# EAGLE design RGF_2_0 (EAGLE 8.3.2)
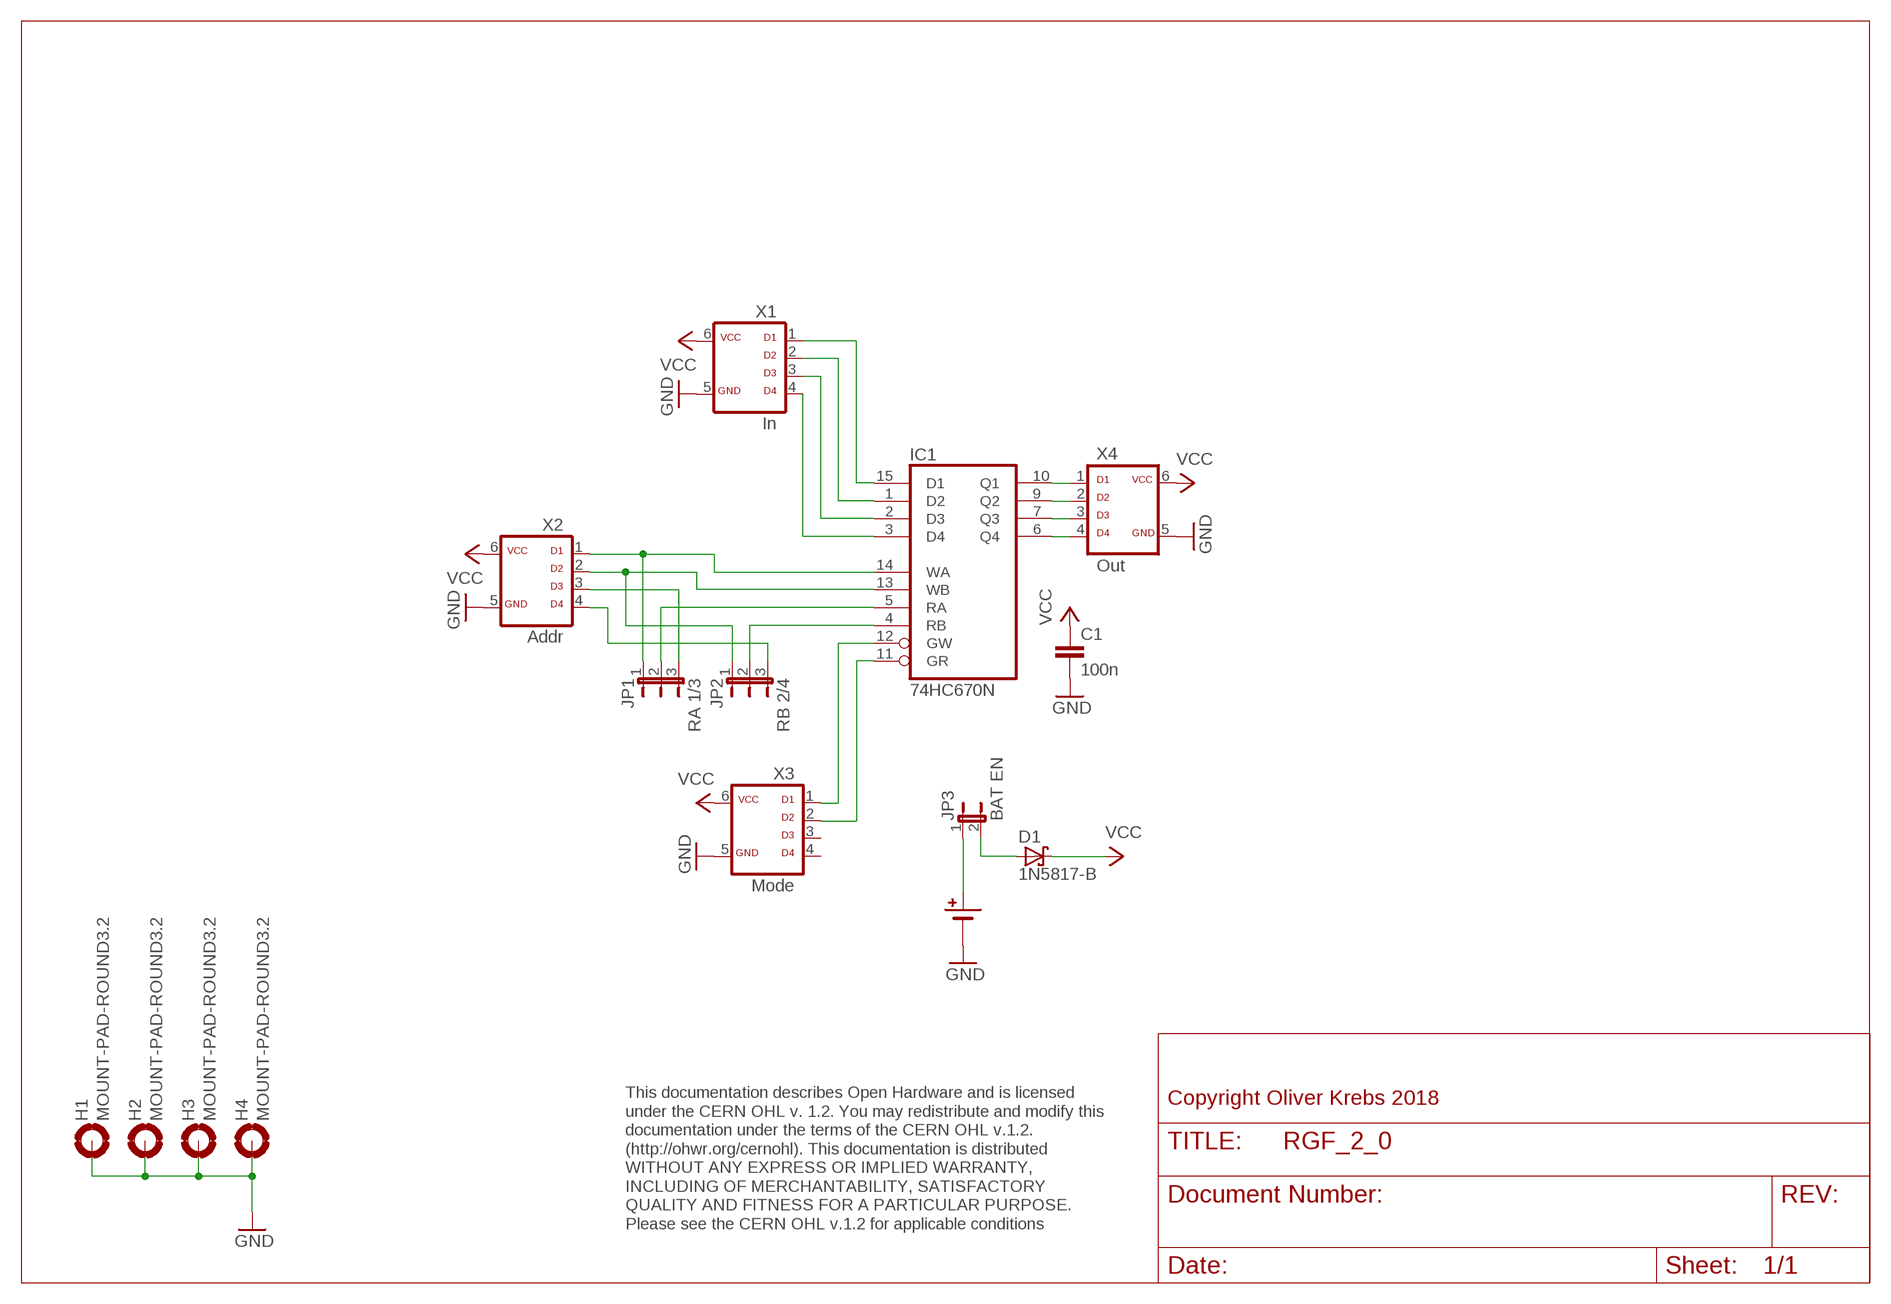
[diagram p0: schematic, sheet 1]

## Parts
C1  100n  C-EU050-025X075  [C050-025X075]
D1  1N5817-B  [DO41-7.6]
H1  MOUNT-PAD-ROUND3.2  [3,2-PAD]
H2  MOUNT-PAD-ROUND3.2  [3,2-PAD]
H3  MOUNT-PAD-ROUND3.2  [3,2-PAD]
H4  MOUNT-PAD-ROUND3.2  [3,2-PAD]
IC1  74HC670N  [DIL16]
JP1  RA 1/3  JP2EJP2-U  [JP2-U]
JP2  RB 2/4  JP2EJP2-U  [JP2-U]
JP3  BAT EN  JP1E  [JP1]
X1  In  ML6D  [ML-6]
X2  Addr  ML6D  [ML-6]
X3  Mode  ML6D  [ML-6]
X4  Out  ML6D  [ML-6]
X5  BATTERY  [KZH20SMD]

## Nets
GND: C1.2 H1.B3,2(MOUNT) H2.B3,2(MOUNT) H3.B3,2(MOUNT) H4.B3,2(MOUNT) X1.5 X2.5 X3.5 X4.5 X5.N1(MINUS)
N$1: IC1.15(D1) X1.1
N$2: IC1.1(D2) X1.2
N$3: IC1.2(D3) X1.3
N$4: IC1.3(D4) X1.4
N$5: IC1.9(Q2) X4.2
N$6: IC1.10(Q1) X4.1
N$7: IC1.7(Q3) X4.3
N$8: IC1.6(Q4) X4.4
N$9: IC1.14(WA) JP1.1 X2.1
N$10: JP1.3 X2.3
N$11: JP3.1 X5.P1(PLUS) X5.P2(PLUS)
N$13: JP2.3 X2.4
N$14: IC1.13(WB) JP2.1 X2.2
N$15: IC1.4(RB) JP2.2
N$16: IC1.5(RA) JP1.2
N$17: D1.A JP3.2
N$22: IC1.12(GW) X3.1
N$23: IC1.11(GR) X3.2
VCC: C1.1 D1.C X1.6 X2.6 X3.6 X4.6
Unconnected: X3.3 X3.4

## Notes on the sheet
- Copyright Oliver Krebs 2018
- This documentation describes Open Hardware and is licensed 
  under the CERN OHL v. 1.2. You may redistribute and modify this 
  documentation under the terms of the CERN OHL v.1.2. 
  (http://ohwr.org/cernohl). This documentation is distributed
  WITHOUT ANY EXPRESS OR IMPLIED WARRANTY, 
  INCLUDING OF MERCHANTABILITY, SATISFACTORY 
  QUALITY AND FITNESS FOR A PARTICULAR PURPOSE. 
  Please see the CERN OHL v.1.2 for applicable conditions

## Power pins joined to a net without a drawn wire
GND: IC1.8(GND)
VCC: IC1.16(VCC)

## Library data of the parts
C1 = 01-my_rcl:C-EU: CAPACITOR, European symbol
D1 = 01-my-diode:1N581*: 1.0A SCHOTTKY BARRIER RECTIFIER Source: http://www.diodes.com/datasheets/ds23001.pdf
H1-H4 = holes:MOUNT-PAD-ROUND: MOUNTING PAD, round
IC1 = 74xx-eu:74*670: 4 by 4 REGISTER FILES, 3-state
JP1 JP2 = 01-my-jumper:JP2E: JUMPER
JP3 = 01-my-jumper:JP1E: JUMPER
X1-X4 = 01-my-con:ML6D
X5 = 01-my-con:BATTERY

## Board
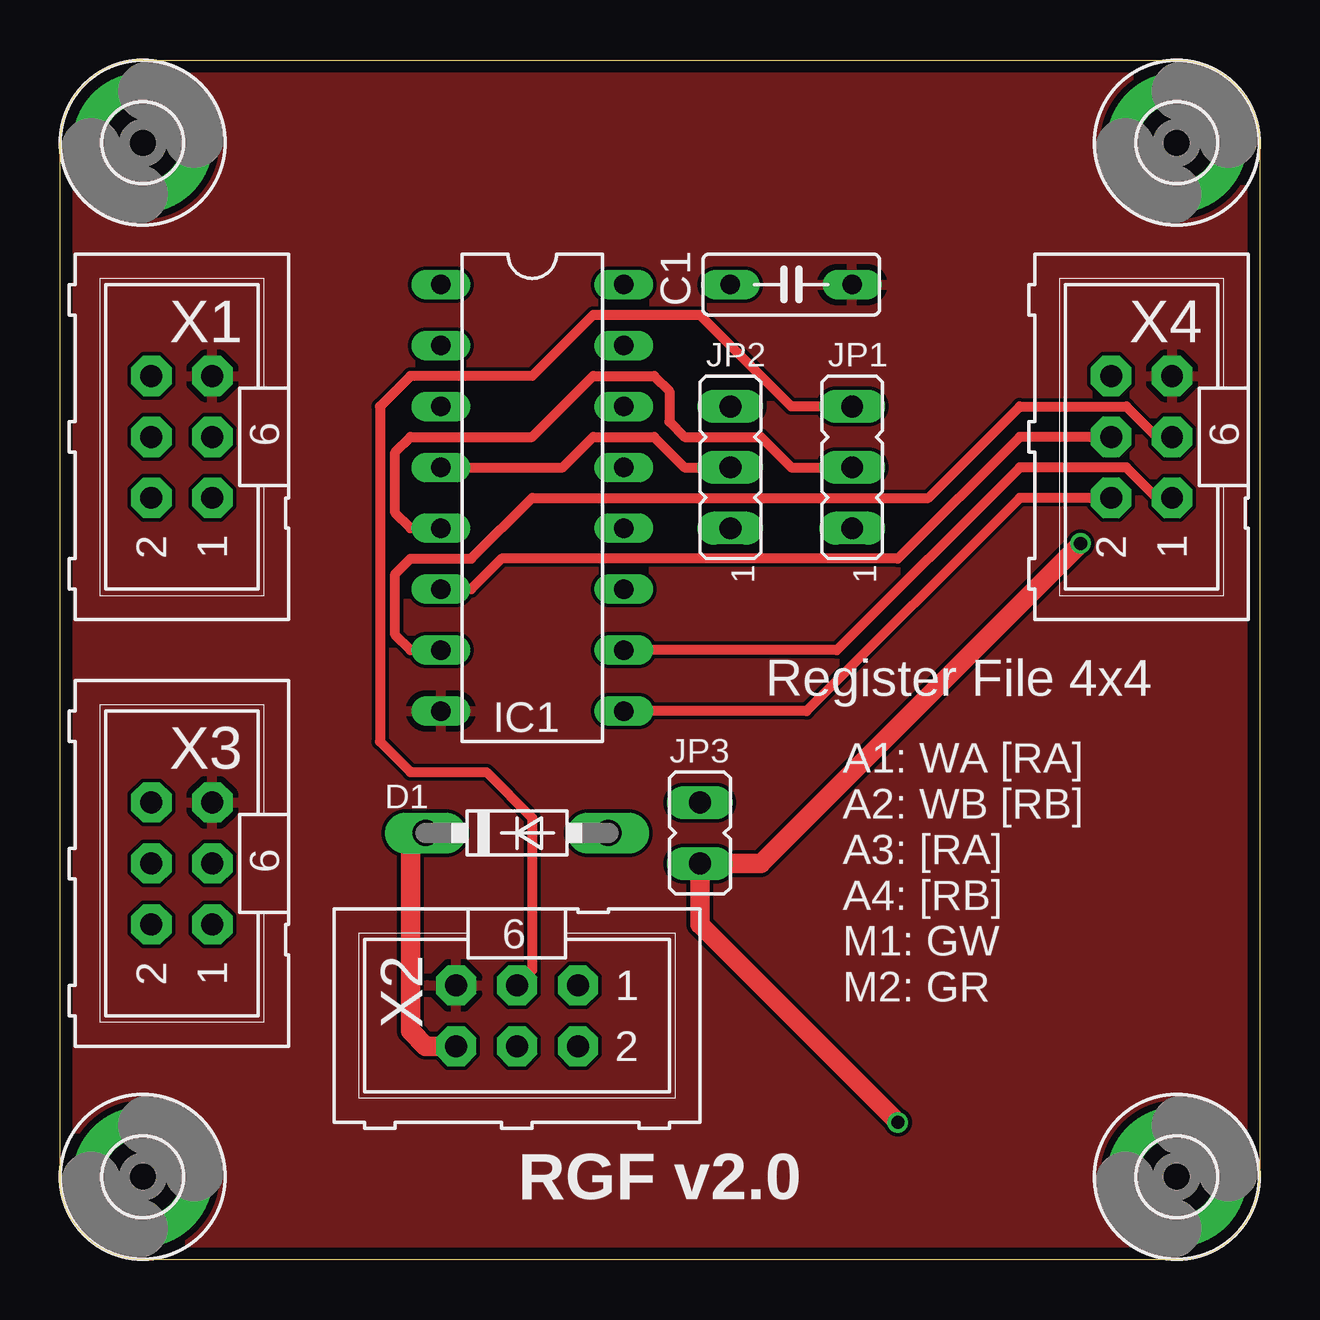
[diagram p1: board, top side]
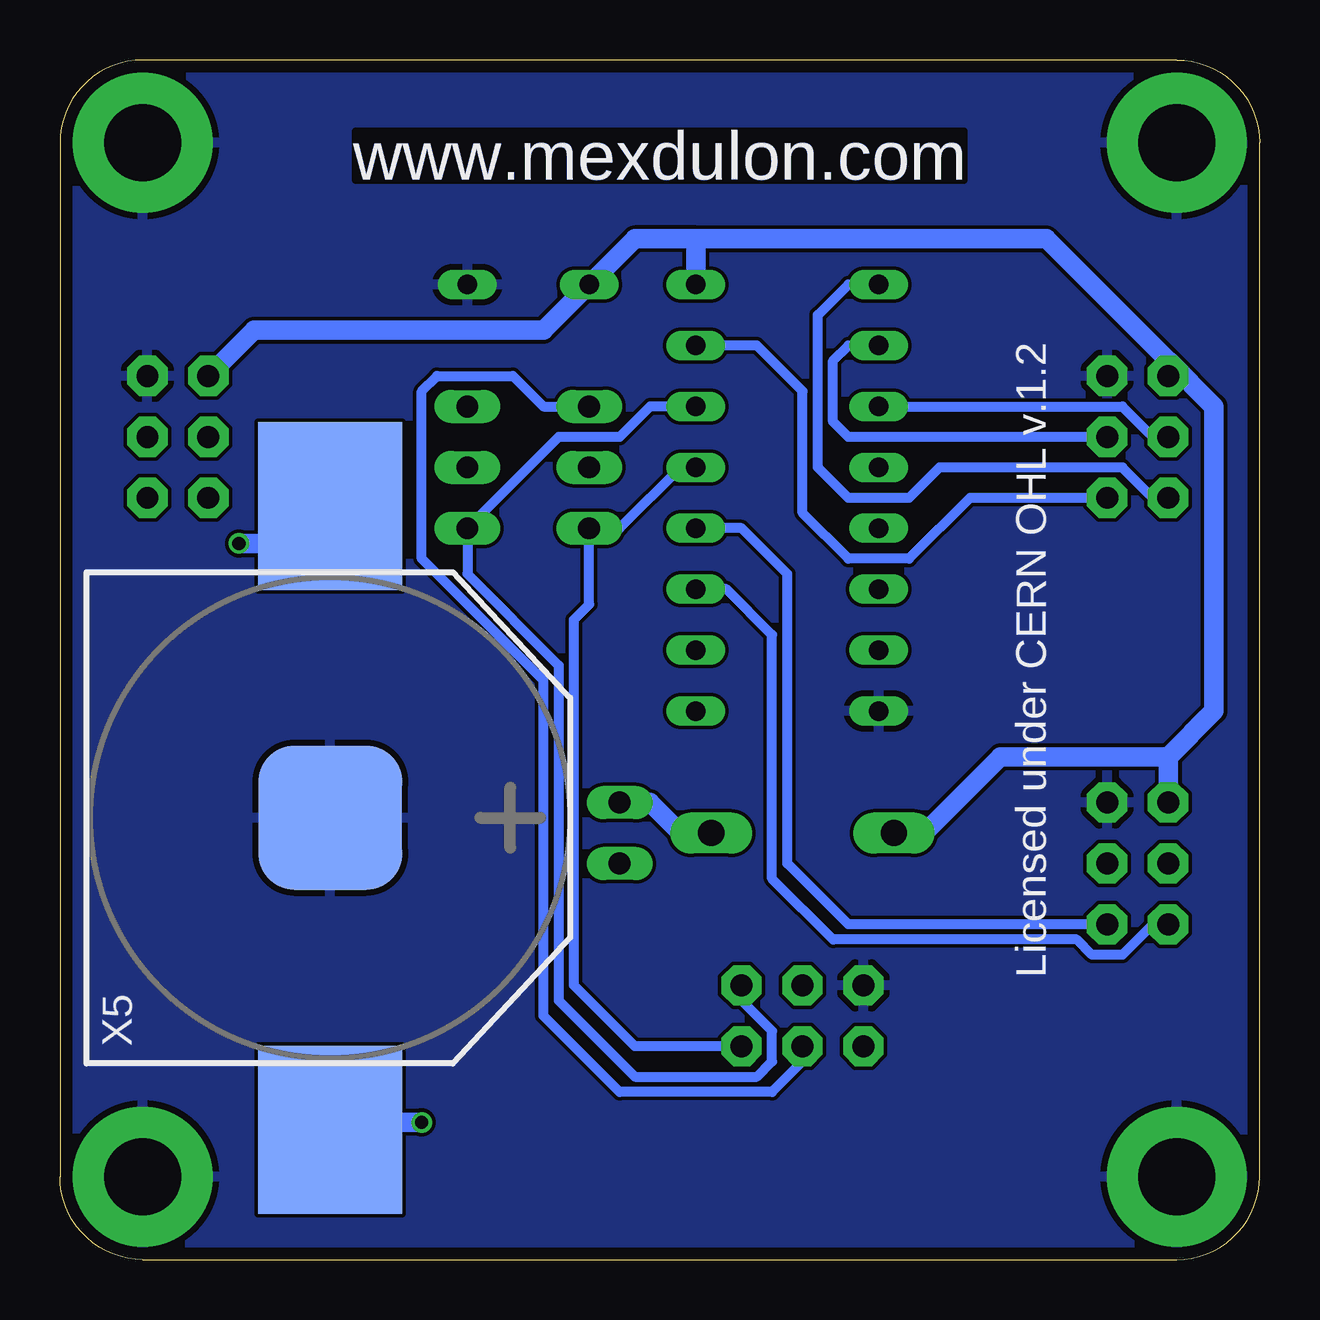
[diagram p2: board, bottom side, seen from below]

Size 50 x 50 mm. Coordinates in mm from the lower left corner, seen from the top.
Outline: 0,3.45 0,46.55 arc-90 3.45,50 46.55,50 arc-90 50,46.55 50,3.45 arc-90 46.55,0 3.45,0 arc-90 0,3.45
Copper layers (1*16): Top 0.035mm / dielectric 1.6mm / Bottom 0.035mm
Design rules "Elecrow_2-layer_PCB_eagle_rule *": minimum track width 6mil, minimum drill 12mil, track to track 6mil, track to pad 6mil, pad to pad 6mil, via to via 8mil, smd to smd 0mil, copper to edge 20mil, drill to drill 10mil, minimum pad ring 6mil, minimum via ring 6mil, stop-mask expansion 0mil, vias tented up to drill 100mil, thermal gap 10mil

### Footprints (pad centres in the part's own frame; a part is rotated, then mirrored left to right if it is on the bottom)
C050-025X075 = drill 0.813 long: 1 -2.54,0; 2 2.54,0
DO41-7.6 = drill 1.1 pad 1.7 long: A 3.81,0; C -3.81,0
3,2-PAD = drill 3.2 pad 5.842: B3,2 0,0
DIL16 = drill 0.813 long: 1 -8.89,-3.81; 2 -6.35,-3.81; 3 -3.81,-3.81; 4 -1.27,-3.81; 5 1.27,-3.81; 6 3.81,-3.81; 7 6.35,-3.81; 8 8.89,-3.81; 9 8.89,3.81; 10 6.35,3.81; 11 3.81,3.81; 12 1.27,3.81; 13 -1.27,3.81; 14 -3.81,3.81; 15 -6.35,3.81; 16 -8.89,3.81
JP2-U = drill 0.914 long: 1 -2.54,0; 2 0,0; 3 2.54,0
JP1 = drill 0.914 long: 1 0,-1.27; 2 0,1.27
ML-6 = drill 0.914 pad 1.676 octagon: 1 -2.54,-1.27; 2 -2.54,1.27; 3 0,-1.27; 4 0,1.27; 5 2.54,-1.27; 6 2.54,1.27
KZH20SMD = smd 6 x 6: N1 0,0 | smd 7 x 6: P1 -13,0; P2 13,0

### Placement (x,y rotation side)
C1  30.48,40.64 0 top
D1  19.05,17.78 0 top
H1  3.45,3.45 0 top
H2  3.45,46.55 0 top
H3  46.55,46.55 0 top
H4  46.55,3.45 0 top
IC1  19.68,31.75 270 top
JP1  33.02,33.02 90 top
JP2  27.94,33.02 90 top
JP3  26.67,17.78 0 top
X1  5.08,34.29 90 top
X2  19.05,10.16 180 top
X3  5.08,16.51 90 top
X4  45.09,34.29 90 top
X5  38.73,18.41 90 bottom

### Tracks (layer width: path | path; a pad name or v marks a point on that pad's centre or on a via)
GND
  pour Bottom: 0,50.16 50.16,50.16 50.16,0 0,0
  pour Top: 0,50.16 50.16,50.16 50.16,0 0,0
N$1
  Bottom 0.406: X1.1 12.06,31.75 14.61,29.21 17.14,29.21 19.05,31.11 19.05,36.2 20.95,38.1 IC1.15
N$2
  Bottom 0.406: X1.2 4.45,31.75 5.71,33.02 13.34,33.02 14.61,31.75 17.14,31.75 18.41,33.02 18.41,39.37 17.14,40.64 IC1.1
N$3
  Bottom 0.406: X1.3 17.14,34.29 17.78,34.92 17.78,37.47 17.14,38.1 IC1.2
N$4
  Bottom 0.406: IC1.3 5.71,35.56 4.45,34.29 X1.4
N$5
  Top 0.406: X4.2 40.01,31.75 31.11,22.86 IC1.9
N$6
  Top 0.406: X4.1 45.72,31.75 44.45,33.02 40.01,33.02 32.38,25.4 IC1.10
N$7
  Top 0.406: IC1.7 14.61,25.4 13.97,26.04 13.97,28.57 14.61,29.21 17.14,29.21 19.68,31.75 36.2,31.75 40.01,35.56 44.45,35.56 45.72,34.29 X4.3
N$8
  Top 0.406: X4.4 40.01,34.29 34.92,29.21 18.41,29.21 17.14,27.94 IC1.6
N$9
  Bottom 0.406: IC1.14 25.4,35.56 26.67,34.29 29.21,34.29 JP1.1 33.02,28.57 29.21,24.77 29.21,10.79 26.04,7.62 20.95,7.62 20.32,8.26 20.32,9.53 21.59,10.79 X2.1
N$10
  Top 0.406: JP1.3 30.48,35.56 26.67,39.37 22.23,39.37 19.68,36.83 14.61,36.83 13.34,35.56 13.34,21.59 14.61,20.32 17.78,20.32 19.68,18.41 19.68,12.06 X2.3
N$11  (via drill 0.55)
  Top 0.813: v34.92,5.71 26.67,13.97 JP3.1 29.21,16.51 v42.55,29.84
  Bottom 0.813: v34.92,5.71 38.1,5.71 38.73,5.08 X5.P1 | v42.55,29.84 40.3,29.84 X5.P2
N$13
  Bottom 0.406: X2.4 19.05,8.26 20.32,6.99 26.67,6.99 29.84,10.16 29.84,24.13 34.92,29.21 34.92,36.2 34.29,36.83 31.11,36.83 29.84,35.56 JP2.3
N$14
  Bottom 0.406: IC1.13 24.13,33.02 26.67,30.48 JP2.1 27.94,27.3 28.57,26.67 28.57,11.43 26.04,8.89 X2.2
N$15
  Top 0.406: IC1.4 20.95,33.02 22.23,34.29 24.77,34.29 26.04,33.02 JP2.2
N$16
  Top 0.406: IC1.5 14.61,30.48 13.97,31.11 13.97,33.66 14.61,34.29 19.68,34.29 22.23,36.83 24.77,36.83 25.4,36.2 25.4,34.92 26.04,34.29 29.21,34.29 30.48,33.02 JP1.2
N$17
  Bottom 0.813: JP3.2 25.4,19.05 24.13,17.78 D1.A
N$22
  Bottom 0.406: X3.1 17.14,13.97 19.68,16.51 19.68,28.57 21.59,30.48 IC1.12
N$23
  Bottom 0.406: X3.2 4.45,13.97 5.71,12.7 6.99,12.7 7.62,13.34 17.78,13.34 20.32,15.88 20.32,26.04 22.23,27.94 IC1.11
VCC
  Top 0.813: X2.6 15.24,8.89 14.61,9.53 14.61,17.14 D1.C
  Bottom 0.813: 3.81,20.95 X3.6 | 3.81,20.95 10.79,20.95 13.97,17.78 D1.C | 3.81,37.47 1.91,35.56 1.91,22.86 3.81,20.95 | X1.6 3.81,37.47 | 3.81,37.47 8.89,42.55 23.5,42.55 | 23.5,42.55 26.04,42.55 C1.1 29.84,38.73 41.91,38.73 X4.6 | IC1.16 23.5,42.55

### Text on the board
Bottom: www.mexdulon.com
bPlace: www.mexdulon.com | Licensed under CERN OHL v.1.2
tNames: Register File 4x4 | A1: WA [RA] / A2: WB [RB] / A3: [RA] / A4: [RB] / M1: GW / M2: GR | RGF v2.0
bValues: 3V | CR2016 / CR2025 / CR2032
200bmp: E:/Bilder/Elektronik/Modulion/Mexdulon/mexdulon_50x50_pcb.bmp